# Altium schematic sheet driver_V1.6.SchDoc
size A4
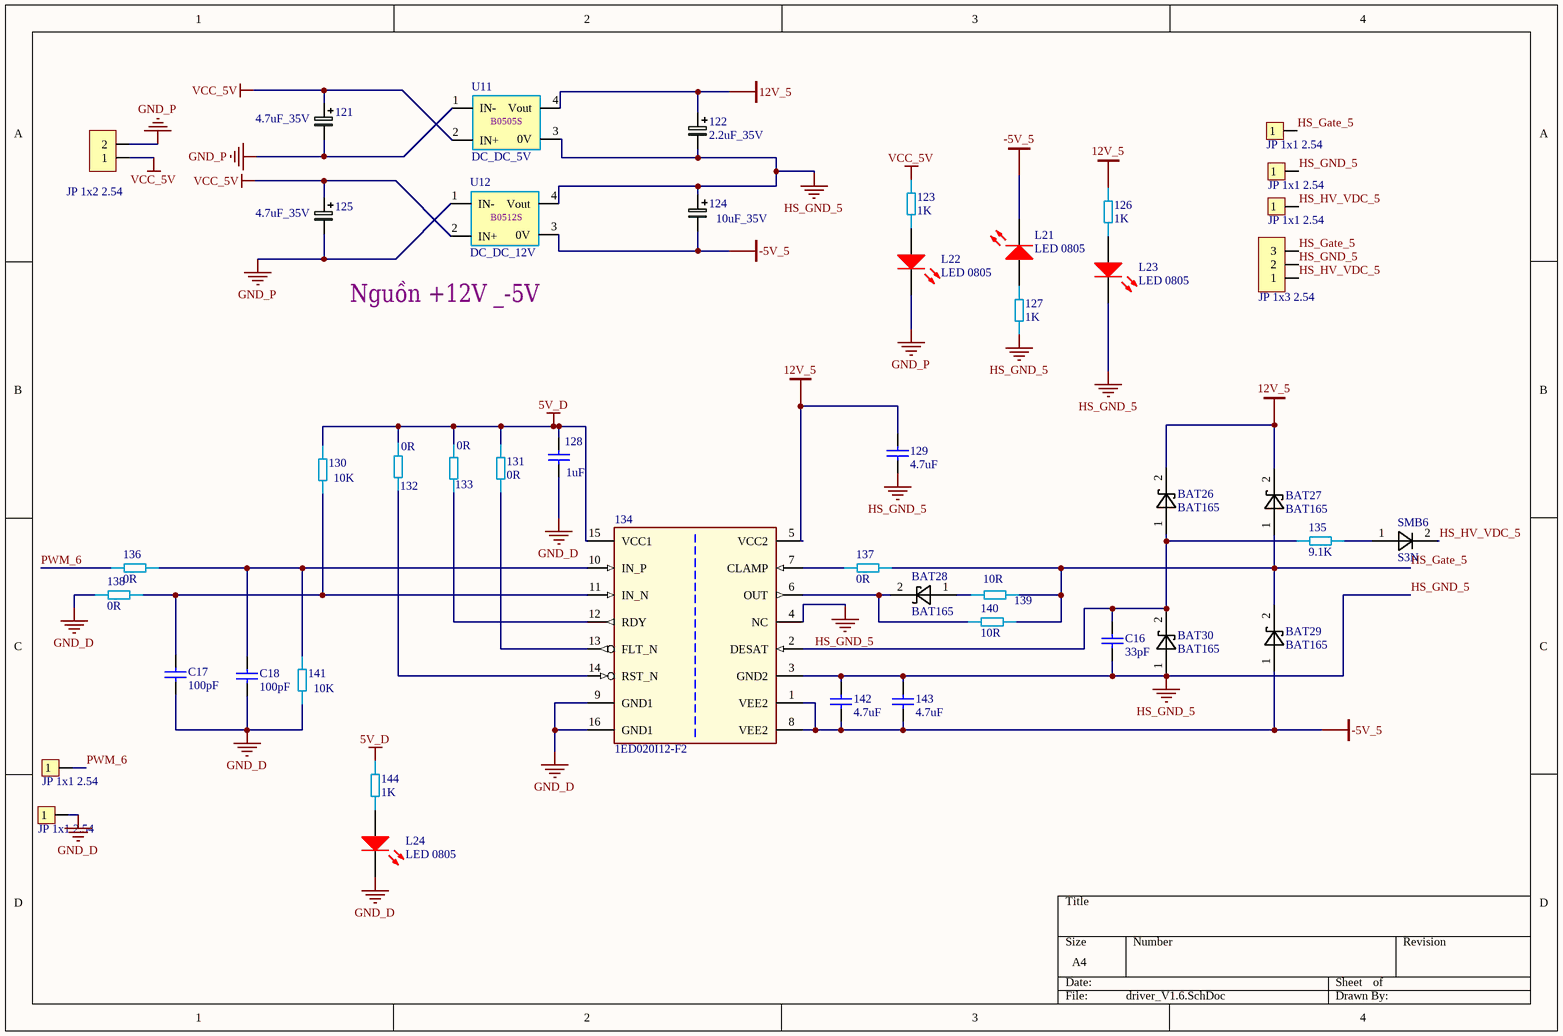
[diagram p0: driver_V1.6.SchDoc]

## Parts
121  4.7uF_35V  [tu_4x5.4mm]
122  2.2uF_35V  [tu_4x5.4mm]
123  1K  [RES1206]
124  10uF_35V  [tu_4x5.4mm]
125  4.7uF_35V  [tu_4x5.4mm]
126  1K  [RES1206]
127  1K  [RES1206]
128  1uF  [Tu 0805_N]
129  4.7uF  [tu 1206_N]
130  10K  [RES1206]
131  0R  [RES1206]
132  0R  [RES1206]
133  0R  [RES1206]
134  1ED020I12-F2  [SOIC127P1028X264-16N-1]
135  9.1K  [RES_2512]
136  0R  [RES1206]
137  0R  [RES_2512]
138  0R  [RES1206]
139  10R  [RES_2512]
140  10R  [RES_2512]
141  10K  [RES1206]
142  4.7uF  [tu 1206_N]
143  4.7uF  [tu 1206_N]
144  1K  [RES1206]
BAT26  BAT165  [SMB]
BAT27  BAT165  [SMB]
BAT28  BAT165  [SMB]
BAT29  BAT165  [SMB]
BAT30  BAT165  [SMB]
C16  33pF  [Tu 0805_N]
C17  100pF  [Tu 0805_N]
C18  100pF  [Tu 0805_N]
JP37  JP 1x1 2.54  [test_point]
JP38  JP 1x2 2.54  [JP 1x2 DT_n]
JP39  JP 1x1 2.54  [test_point]
JP40  JP 1x1 2.54  [test_point]
JP41  JP 1x3 2.54  [XH2.54M-3]
JP42  JP 1x1 2.54  [test_point]
JP43  JP 1x1 2.54  [test_point]
L21  LED 0805  [LED-0805-Red]
L22  LED 0805  [LED-0805-Red]
L23  LED 0805  [LED-0805-Red]
L24  LED 0805  [LED-0805-Red]
SMB6  S3N  [SMB]
U11  DC_DC_5V  [B0505S/D-1W]
U12  DC_DC_12V  [B0512S/D-1W]

## Nets
5V_D: 128.2 130.2 131.1 132.2 133.1 134.15(VCC1) 144.1
12V_5: 122.1 126.1 129.2 134.5(VCC2) BAT26.2 BAT27.2 U11.4(Vout)
-5V_5: 124.2 134.1(VEE2) 134.8(VEE2) 142.1 143.1 BAT29.1 L21.2(K) U12.3(0V)
GND_D: 128.1 134.9(GND1) 134.16(GND1) 138.2 141.1 C17.1 C18.1 JP43.1 L24.2(K)
GND_P: 121.2 125.2 JP38.2 L22.2(K) U11.1(IN-) U12.1(IN-)
HS_GND_5: 122.2 124.1 127.2 129.1 134.3(GND2) 134.4(NC) 142.2 143.2 BAT30.1 C16.1 JP39.1 JP41.2 L23.2(K) U11.3(0V) U12.4(Vout)
VCC_5V: 121.1 123.1 125.1 JP38.1 U11.2(IN+) U12.2(IN+)
HS_Gate_5: 137.2 139.2 140.2 BAT27.1 BAT29.2 JP37.1 JP41.3
HS_HV_VDC_5: JP40.1 JP41.1 SMB6.2
PWM_6: 136.2 JP42.1
Net123_2: 123.2 L22.1(A)
Net126_2: 126.2 L23.1(A)
Net127_1: 127.1 L21.1(A)
Net130_1: 130.1 134.11(IN_N) 138.1 C17.2
Net131_2: 131.2 134.13(FLT_N)
Net132_1: 132.1 134.14(RST_N)
Net133_2: 133.2 134.12(RDY)
Net134_2: 134.2(DESAT) 135.1 BAT26.1 BAT30.2 C16.2
Net134_6: 134.6(OUT) 140.1 BAT28.2
Net134_7: 134.7(CLAMP) 137.1
Net134_10: 134.10(IN_P) 136.1 141.2 C18.2
Net135_2: 135.2 SMB6.1
Net139_1: 139.1 BAT28.1
Net144_2: 144.2 L24.1(A)

## Notes on the sheet
- Nguồn +12V _-5V
- (in symbol DC_DC_5v) B0505S
- (in symbol DC_DC_12v) B0512S

## Library data of the parts
121 122 124 125 = capacitor_electric
123 126 127 130-133 135-141 144 = 311-0.0GRTR-ND
128 C16-C18 = cap_0805
129 142 143 = cap_1210
134 = 1ED020I12-F2: Single IGBT Driver IC; Manufacturer: Infineon Technologies; Manufacturer Order Number: 1ED020I12-F2; PackageReference: PG-DSO-16-15
JP37 JP39 JP40 JP42 JP43 = JP 1x1 2.54 Duc Thang: Cắm; Ten_Linh_Kien: Jump Đơn Đực 2.54MM 1x40P Thẳng 11MM; Don_Vi: Con; Ma_Hang: MH000903; Ghi_Chu: *; Kieu_Chan: *; Chung_Loai: Cắm
JP38 = JP 1x2 2.54 Duc Thang: Cắm; Ten_Linh_Kien: Jump Đơn Đực 2.54MM 1x40P Thẳng 11MM; Don_Vi: Con; Ma_Hang: MH000903; Ghi_Chu: *; Kieu_Chan: *; Chung_Loai: Cắm
JP41 = JP 1x3 2.54 Duc Cong: Cắm; Ten_Linh_Kien: Jump Đơn Đực 2.54MM 1x40P Cong Đứng; Don_Vi: Con; Ma_Hang: MH000904; Ghi_Chu: *; Kieu_Chan: *; Chung_Loai: Cắm
L21-L24 = LED 0805 Do: Dán; Don_Vi: Con; Ma_Hang: MH000897; Ten_Linh_Kien: LED 0805 Màu Đỏ (Red); Ghi_Chu: *; Kieu_Chan: *; Chung_Loai: Dán
SMB6 = S3A-S3N